# EAGLE schematic Lighting Board (EAGLE 6.5.0)
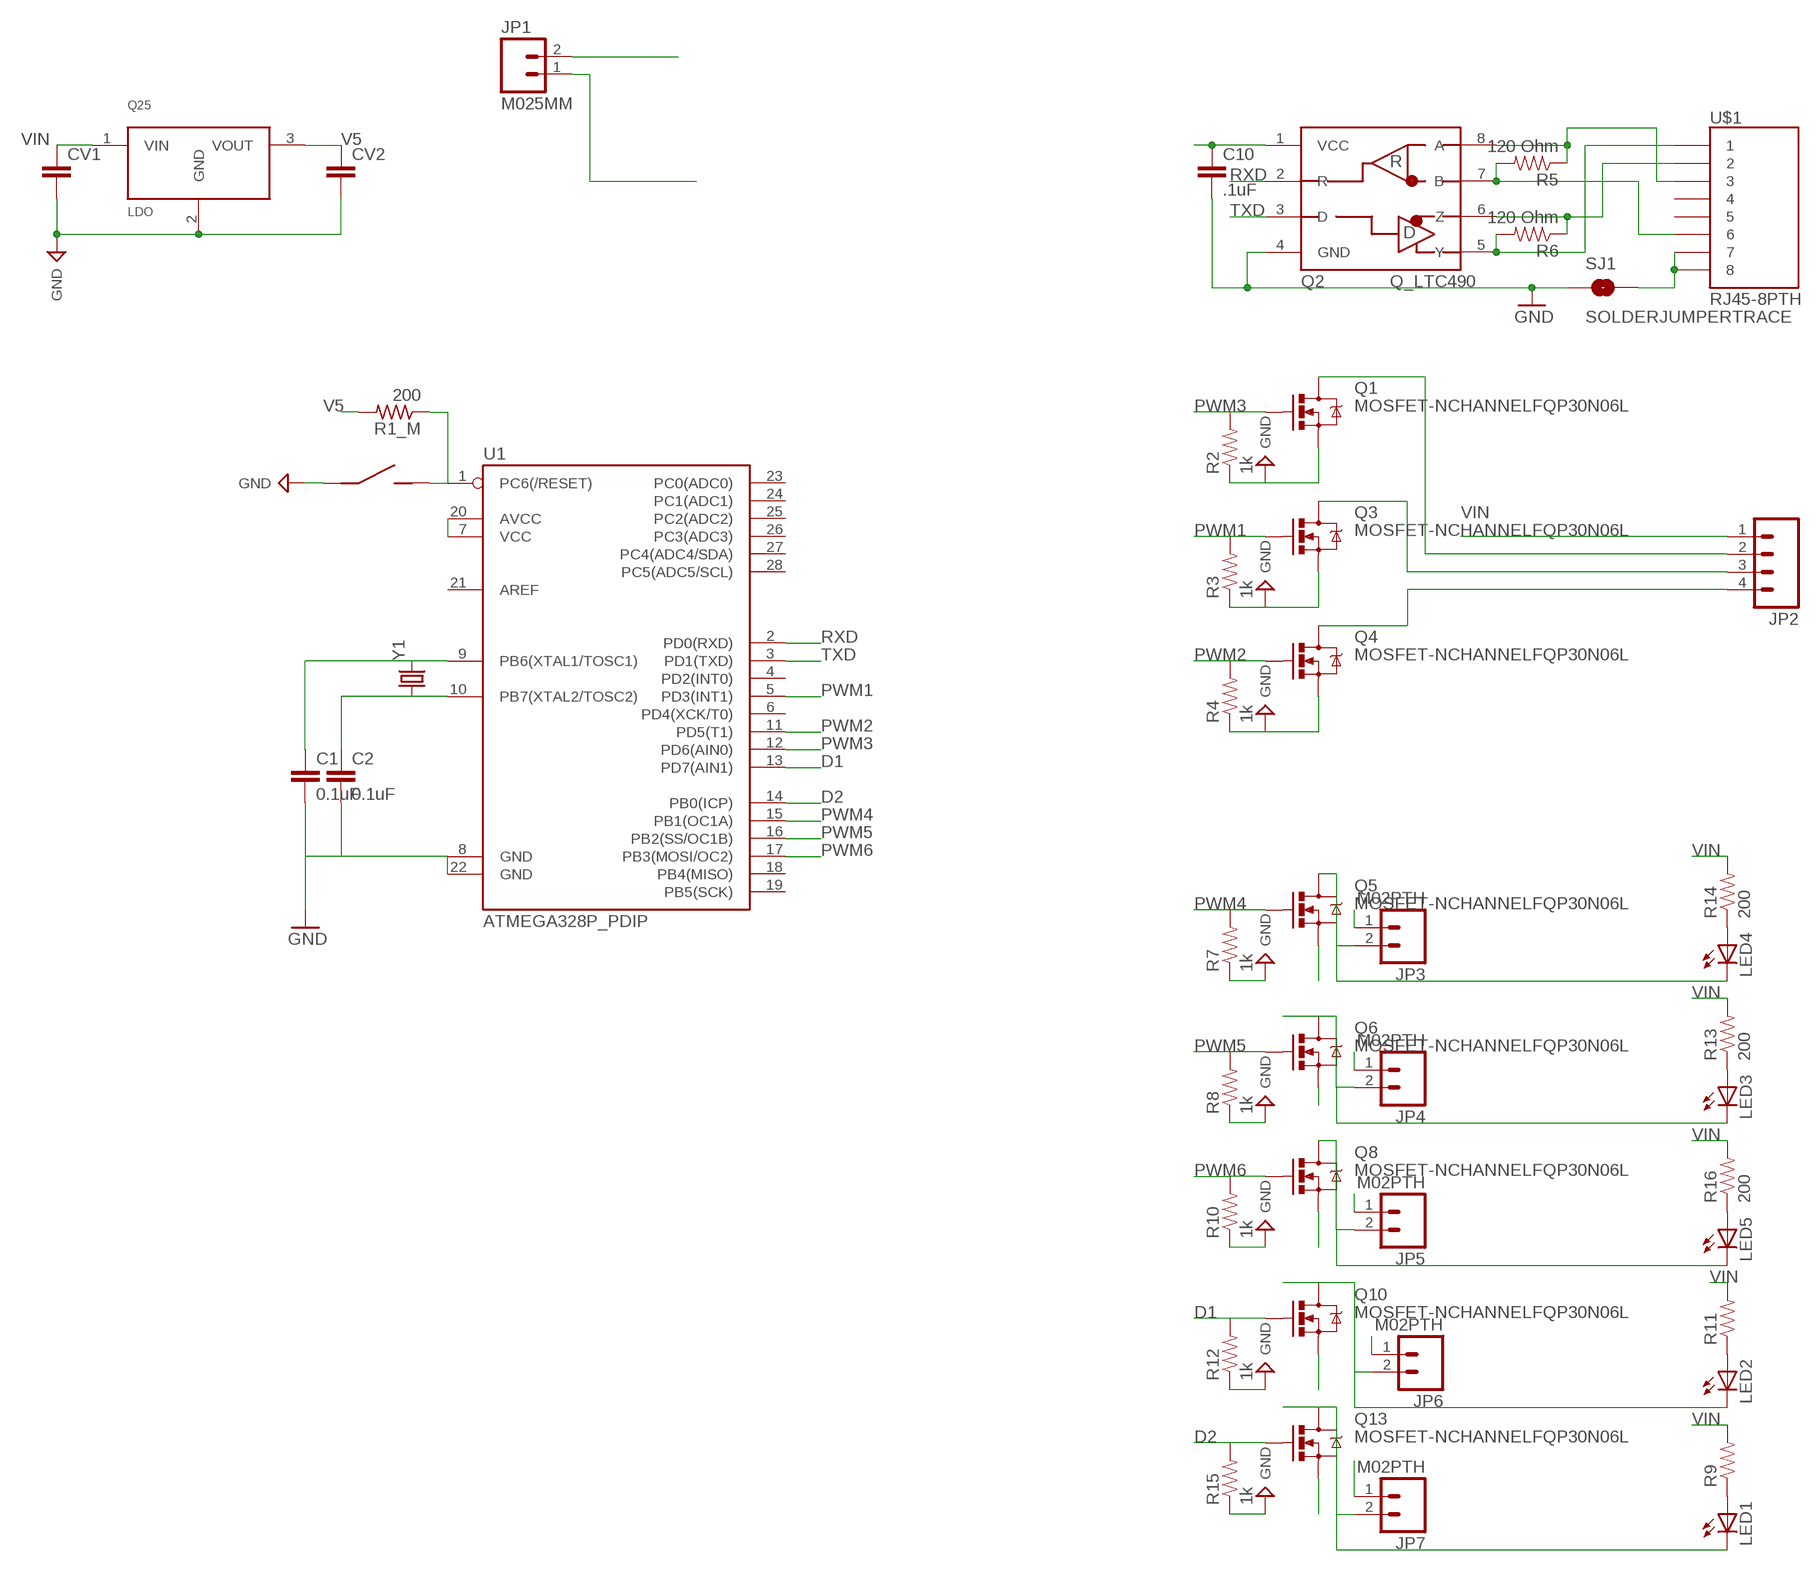
[diagram p0: schematic, sheet 1]

## Parts
C1  0.1uF  CAP1206  [1206]
C2  0.1uF  CAP1206  [1206]
C10  .1uF  2.2UF-CERCAP-10009  [1206]
CV1  C_CAP_0805  [C_0805]
CV2  C_CAP_0805  [C_0805]
JP1  M025MM  [SCREWTERMINAL-5MM-2]
JP2  M04PTH  [1X04]
JP3  M02PTH  [1X02]
JP4  M02PTH  [1X02]
JP5  M02PTH  [1X02]
JP6  M02PTH  [1X02]
JP7  M02PTH  [1X02]
LED1  LED1206  [LED-1206]
LED2  LED1206  [LED-1206]
LED3  LED1206  [LED-1206]
LED4  LED1206  [LED-1206]
LED5  LED1206  [LED-1206]
MS  J_MC32857  [J_TOGGLE]
Q1  MOSFET-NCHANNELFQP30N06L  [TO220V]
Q2  Q_LTC490  [DIP8]
Q3  MOSFET-NCHANNELFQP30N06L  [TO220V]
Q4  MOSFET-NCHANNELFQP30N06L  [TO220V]
Q5  MOSFET-NCHANNELFQP30N06L  [TO220V]
Q6  MOSFET-NCHANNELFQP30N06L  [TO220V]
Q8  MOSFET-NCHANNELFQP30N06L  [TO220V]
Q10  MOSFET-NCHANNELFQP30N06L  [TO220V]
Q13  MOSFET-NCHANNELFQP30N06L  [TO220V]
Q25  LDO  Q_LDO  [TO-220]
R1_M  200  R_RES_0805  [R_0805]
R2  1k  RESISTOR1206  [1206]
R3  1k  RESISTOR1206  [1206]
R4  1k  RESISTOR1206  [1206]
R5  120 Ohm  RESISTOR1206  [1206]
R6  120 Ohm  RESISTOR1206  [1206]
R7  1k  RESISTOR1206  [1206]
R8  1k  RESISTOR1206  [1206]
R9  RESISTOR1206  [1206]
R10  1k  RESISTOR1206  [1206]
R11  RESISTOR1206  [1206]
R12  1k  RESISTOR1206  [1206]
R13  200  RESISTOR1206  [1206]
R14  200  RESISTOR1206  [1206]
R15  1k  RESISTOR1206  [1206]
R16  200  RESISTOR1206  [1206]
SJ1  SOLDERJUMPERTRACE  [SJ_2S-TRACE]
U1  ATMEGA328P_PDIP  [DIL28-3]
U$1  RJ45-8PTH  [RJ45-8]
Y1  CRYSTALHC49US  [HC49US]

## Nets
D1: Q10.1(G) R12.2 U1.13(PD7(AIN1))
D2: Q13.1(G) R15.2 U1.14(PB0(ICP))
GND: C1.2 C2.2 C10.2 CV1.2 CV2.2 JP1.2 MS.P$1 Q1.3(S) Q2.4(GND) Q3.3(S) Q4.3(S) Q5.3(S) Q6.3(S) Q8.3(S) Q10.3(S) Q13.3(S) Q25.2(GND) R2.1 R3.1 R4.1 R7.1 R8.1 R10.1 R12.1 R15.1 SJ1.1 U1.8(GND) U1.22(GND) ; supply symbol labelled SUP_GND
N$1: Q2.5(Y) R6.2 U$1.1
N$2: C2.1 U1.10(PB7(XTAL2/TOSC2)) Y1.1
N$4: LED1.A R9.1
N$5: LED2.A R11.1
N$6: LED3.A R13.1
N$7: LED4.A R14.1
N$8: LED5.A R16.1
N$9: Q2.6(Z) R6.1 U$1.2
N$10: Q2.7(B) R5.2 U$1.6
N$11: Q2.8(A) R5.1 U$1.3
N$12: SJ1.2 U$1.7 U$1.8
N$13: C1.1 U1.9(PB6(XTAL1/TOSC1)) Y1.2
N$15: JP2.2 Q1.2(D)
N$16: JP2.3 Q3.2(D)
N$17: JP2.4 Q4.2(D)
N$88: MS.P$2 R1_M.1 U1.1(PC6(/RESET))
N%2: JP4.2 LED3.C Q6.2(D)
N%3: JP3.2 LED4.C Q5.2(D)
N%106: JP5.2 LED5.C Q8.2(D)
N%107: JP6.2 LED2.C Q10.2(D)
N%110: JP7.2 LED1.C Q13.2(D)
PWM1: Q3.1(G) R3.2 U1.5(PD3(INT1))
PWM2: Q4.1(G) R4.2 U1.11(PD5(T1))
PWM3: Q1.1(G) R2.2 U1.12(PD6(AIN0))
PWM4: Q5.1(G) R7.2 U1.15(PB1(OC1A))
PWM5: Q6.1(G) R8.2 U1.16(PB2(SS/OC1B))
PWM6: Q8.1(G) R10.2 U1.17(PB3(MOSI/OC2))
RXD: Q2.2(R) U1.2(PD0(RXD))
TXD: Q2.3(D) U1.3(PD1(TXD))
V5: C10.1 CV2.1 Q2.1(VCC) Q25.3(VOUT) R1_M.2 U1.7(VCC) U1.20(AVCC)
VIN: CV1.1 JP1.1 JP2.1 JP3.1 JP4.1 JP5.1 JP6.1 JP7.1 Q25.1(VIN) R9.2 R11.2 R13.2 R14.2 R16.2
Unconnected: U1.4(PD2(INT0)) U1.6(PD4(XCK/T0)) U1.18(PB4(MISO)) U1.19(PB5(SCK)) U1.21(AREF) U1.23(PC0(ADC0)) U1.24(PC1(ADC1)) U1.25(PC2(ADC2)) U1.26(PC3(ADC3)) U1.27(PC4(ADC4/SDA)) U1.28(PC5(ADC5/SCL)) U$1.4 U$1.5

## Library data of the parts
C1 C2 = SparkFun-Passives:CAP: Capacitor Standard 0603 ceramic capacitor, and 0.1" leaded capacitor.
C10 = SparkFun-Retired:2.2UF-CER: 2.2uF Ceramic SMT CAP-07888- 10V, 20% (0603) CAP-10009- 50V, 10% (1206); PROD_ID: CAP-10009; VALUE: 2.2uF
CV1 CV2 = Lib_Passive:C_CAP
JP1 JP3-JP7 = SparkFun-Connectors:M02: Standard 2-pin 0.1" header. Use with - straight break away headers ( PRT-00116) - right angle break away headers (PRT-00553) - swiss pins (PRT-00743) - machine pins (PRT-00117) - female headers (PRT-00115) Molex polarized connector foot print use with: PRT-08233 with associated crimp pins and housings. 2.54_SCREWTERM for use with PRT-10571. 3.5mm Screw Terminal footprints for PRT-08084 5mm Screw Terminal footprints for use with PRT-08433
JP2 = SparkFun-Connectors:M04: Header 4 Standard 4-pin 0.1" header. Use with straight break away headers (SKU : PRT-00116), right angle break away headers (PRT-00553), swiss pins (PRT-00743), machine pins (PRT-00117), and female headers (PRT-00115). Molex polarized connector foot print use with SKU : PRT-08231 with associated crimp pins and housings. 1MM SMD Version SKU: PRT-10208
LED1-LED5 = LilyPad-Wearables:LED: LEDs Standard schematic elements and footprints for 5mm, 3mm, 1206, and 0603 sized LEDs. 5mm - Spark Fun Electronics SKU : Comp-SBL
MS = PCB0M1:J_MC32857: SWITCH, TACTILE, SPST-NO, 50mA, THD
Q1 Q3-Q6 Q8 Q10 Q13 = SparkFun-DiscreteSemi:MOSFET-NCHANNEL: Common NMOSFET Parts MFG P/N Store ID Prod ID FDD8780 TRANS-09984 SI7820DN TRANS-11055 FDS6630A IC-08089 2N7002PW TRANS-11151 FQP30N06L COM-10213 TRANS-10060 BSS123LT1G TRANS-08345 BSS138 TRANS-00830 BS170 2N7000; PROD_ID: TRANS-10060
Q2 = PCB0M1:Q_LTC490: IC, RS422-RS485 DRVR
Q25 = PCB0M1:Q_LDO: LDO with fixed ouput voltage
R1_M = Lib_Passive:R_RES
R2-R16 = SparkFun-Passives:RESISTOR: Resistor Basic schematic elements and footprints for 0603, 1206, and PTH resistors.
SJ1 = SparkFun-Passives:SOLDERJUMPER: Solder Jumper Standard SMD solder jumper. Used to automate production. Two varients : Normally Open and Normally Closed are the same, but have different paste layers. NC will have a large amount of paste and should jumper during reflow.
U1 = SparkFun-DigitalIC:ATMEGA328P_PDIP: uC used in the Arduino 32kb flash, 1k EEPROM, 2k SRAM This is the through-hole version of this chip.
U$1 = SparkFun-Connectors:RJ45-8: RJ45 Jack Simple RJ45, 8-pin connection - connector for common Cat5, Cat5e, and Cat6 Ethernet cables. Footprint not yet proven in production. Connector sku is PRT-00643; Breakout PCB sku is BOB-00716.
Y1 = SparkFun-FreqCtrl:CRYSTAL: Various standard crystals. Proven footprints. Spark Fun Electronics SKU : COM-00534